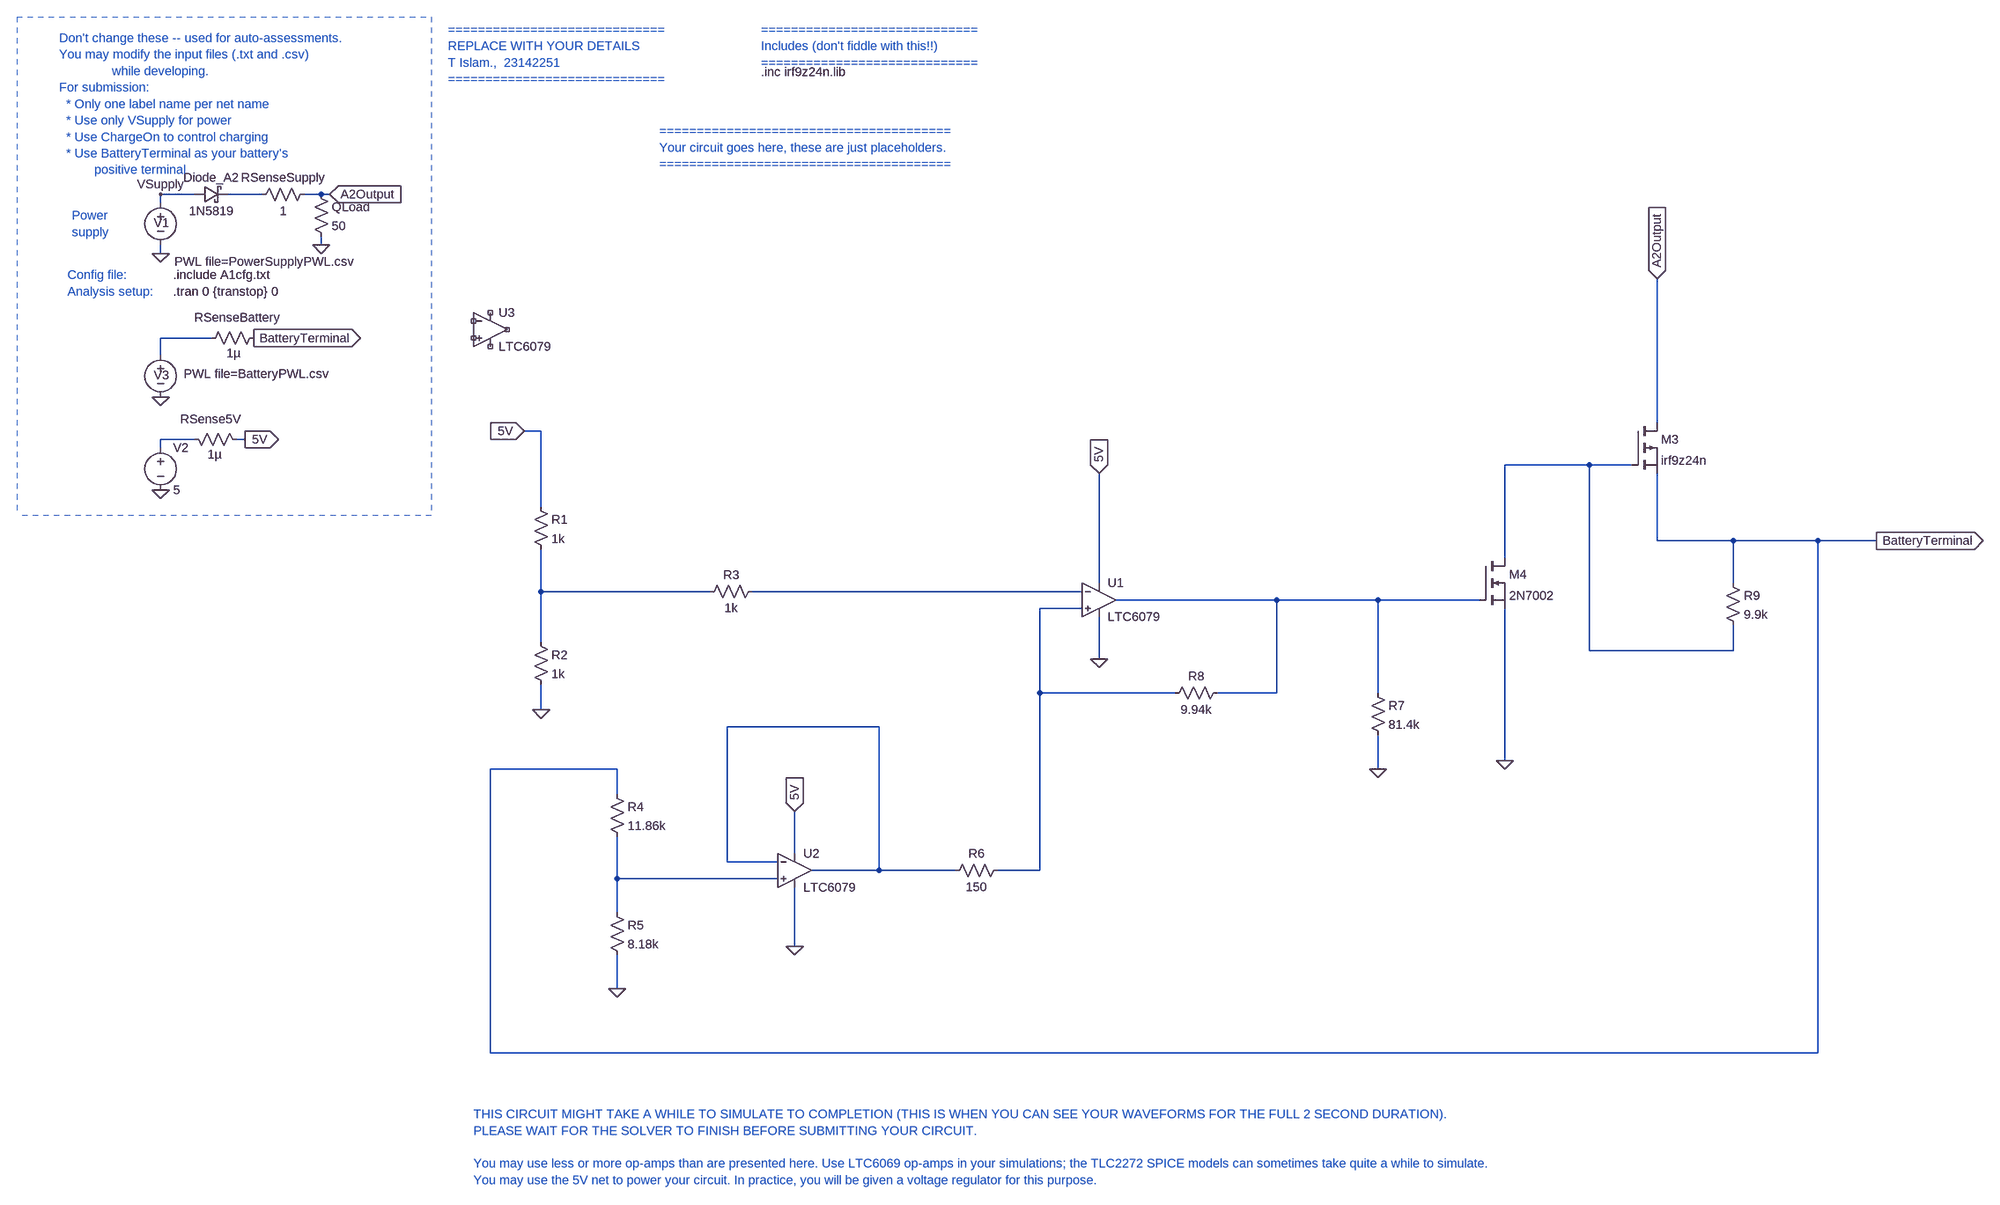
[diagram p0: schematic E344_23142251_A3.asc]
E344_23142251_A3.asc, the LTspice schematic file:
Version 4
SHEET 1 1824 1520
WIRE -2032 -1088 -2096 -1088
WIRE -1904 -1088 -1968 -1088
WIRE -1792 -1088 -1824 -1088
WIRE -1776 -1088 -1792 -1088
WIRE -2096 -1072 -2096 -1088
WIRE -1792 -992 -1792 -1008
WIRE -2096 -976 -2096 -992
WIRE -2000 -816 -2096 -816
WIRE -2096 -784 -2096 -816
WIRE 736 -656 736 -928
WIRE -1376 -640 -1408 -640
WIRE -2032 -624 -2096 -624
WIRE -1936 -624 -1952 -624
WIRE -2096 -608 -2096 -624
WIRE 608 -576 448 -576
WIRE 688 -576 608 -576
WIRE -1376 -496 -1376 -640
WIRE 736 -432 736 -560
WIRE 880 -432 736 -432
WIRE 1040 -432 880 -432
WIRE 1168 -432 1040 -432
WIRE 448 -400 448 -576
WIRE -320 -352 -320 -560
WIRE 880 -352 880 -432
WIRE -1376 -336 -1376 -416
WIRE -1056 -336 -1376 -336
WIRE -352 -336 -976 -336
WIRE 16 -320 -288 -320
WIRE 208 -320 16 -320
WIRE 400 -320 208 -320
WIRE -352 -304 -432 -304
WIRE -1376 -240 -1376 -336
WIRE 608 -224 608 -576
WIRE 880 -224 880 -272
WIRE 880 -224 608 -224
WIRE -320 -208 -320 -288
WIRE -432 -144 -432 -304
WIRE -176 -144 -432 -144
WIRE 16 -144 16 -320
WIRE 16 -144 -96 -144
WIRE 208 -144 208 -320
WIRE -1376 -112 -1376 -160
WIRE -736 -80 -1024 -80
WIRE 448 -16 448 -304
WIRE -1232 0 -1472 0
WIRE 208 0 208 -64
WIRE -1232 48 -1232 0
WIRE -896 160 -896 80
WIRE -1024 176 -1024 -80
WIRE -928 176 -1024 176
WIRE -736 192 -736 -80
WIRE -736 192 -864 192
WIRE -592 192 -736 192
WIRE -432 192 -432 -144
WIRE -432 192 -512 192
WIRE -1232 208 -1232 128
WIRE -928 208 -1232 208
WIRE -1232 272 -1232 208
WIRE -896 336 -896 224
WIRE -1232 416 -1232 352
WIRE -1472 608 -1472 0
WIRE 1040 608 1040 -432
WIRE 1040 608 -1472 608
FLAG -2096 -976 0
FLAG -1776 -1088 A2Output
IOPIN -1776 -1088 In
FLAG -1920 -816 BatteryTerminal
IOPIN -1920 -816 Out
FLAG -2096 -704 0
FLAG -1936 -624 5V
IOPIN -1936 -624 Out
FLAG -2096 -1088 VSupply
FLAG -1792 -992 0
FLAG -2096 -528 0
FLAG 1168 -432 BatteryTerminal
IOPIN 1168 -432 Out
FLAG 736 -928 A2Output
IOPIN 736 -928 In
FLAG -1408 -640 5V
IOPIN -1408 -640 In
FLAG -1376 -112 0
FLAG -1232 416 0
FLAG -320 -208 0
FLAG -896 336 0
FLAG -320 -560 5V
IOPIN -320 -560 In
FLAG -896 80 5V
IOPIN -896 80 In
FLAG 208 0 0
FLAG 448 -16 0
SYMBOL voltage -2096 -1088 R0
WINDOW 123 0 0 Left 0
WINDOW 39 0 0 Left 0
WINDOW 3 26 127 Left 2
WINDOW 0 -13 54 Left 2
SYMATTR Value PWL file=PowerSupplyPWL.csv
SYMATTR InstName V1
SYMBOL res -1904 -832 R90
WINDOW 0 -7 47 VBottom 2
WINDOW 3 29 54 VTop 2
SYMATTR InstName RSenseBattery
SYMATTR Value 1µ
SYMBOL schottky -2032 -1072 R270
WINDOW 0 32 32 VTop 2
WINDOW 3 0 32 VBottom 2
SYMATTR InstName Diode_A2
SYMATTR Value 1N5819
SYMATTR Description Diode
SYMATTR Type diode
SYMBOL voltage -2096 -800 R0
WINDOW 123 0 0 Left 0
WINDOW 39 0 0 Left 0
WINDOW 3 44 52 Left 2
WINDOW 0 -13 54 Left 2
SYMATTR Value PWL file=BatteryPWL.csv
SYMATTR InstName V3
SYMBOL res -1920 -1072 R270
WINDOW 0 32 56 VTop 2
WINDOW 3 0 56 VBottom 2
SYMATTR InstName RSenseSupply
SYMATTR Value 1
SYMBOL res -1808 -1104 R0
SYMATTR InstName QLoad
SYMATTR Value 50
SYMBOL voltage -2096 -624 R0
WINDOW 123 0 0 Left 0
WINDOW 39 0 0 Left 0
SYMATTR InstName V2
SYMATTR Value 5
SYMBOL res -2048 -640 M90
WINDOW 0 -7 47 VBottom 2
WINDOW 3 29 54 VTop 2
SYMATTR InstName RSense5V
SYMATTR Value 1µ
SYMBOL pmos 688 -656 R0
SYMATTR InstName M3
SYMATTR Value irf9z24n
SYMATTR Prefix X
SYMATTR SpiceModel irf9z24n
SYMBOL nmos 400 -400 R0
SYMATTR InstName M4
SYMATTR Value 2N7002
SYMBOL OpAmps\\LTC6079 -320 -320 R0
SYMATTR InstName U1
SYMBOL OpAmps\\LTC6079 -896 192 R0
SYMATTR InstName U2
SYMBOL OpAmps\\LTC6079 -1472 -832 R0
SYMATTR InstName U3
SYMBOL res -1392 -512 R0
SYMATTR InstName R1
SYMATTR Value 1k
SYMBOL res -1392 -256 R0
SYMATTR InstName R2
SYMATTR Value 1k
SYMBOL res -960 -352 R90
WINDOW 0 0 56 VBottom 2
WINDOW 3 32 56 VTop 2
SYMATTR InstName R3
SYMATTR Value 1k
SYMBOL res -1248 32 R0
SYMATTR InstName R4
SYMATTR Value 11.86k
SYMBOL res -1248 256 R0
SYMATTR InstName R5
SYMATTR Value 8.18k
SYMBOL res -496 176 R90
WINDOW 0 0 56 VBottom 2
WINDOW 3 32 56 VTop 2
SYMATTR InstName R6
SYMATTR Value 150
SYMBOL res 192 -160 R0
SYMATTR InstName R7
SYMATTR Value 81.4k
SYMBOL res -80 -160 R90
WINDOW 0 0 56 VBottom 2
WINDOW 3 32 56 VTop 2
SYMATTR InstName R8
SYMATTR Value 9.94k
SYMBOL res 864 -368 R0
SYMATTR InstName R9
SYMATTR Value 9.9k
TEXT -2072 -904 Left 2 !.tran 0 {transtop} 0
TEXT -2072 -936 Left 2 !.include A1cfg.txt
TEXT -2288 -1384 Left 2 ;Don't change these -- used for auto-assessments.\nYou may modify the input files (.txt and .csv) \n               while developing.\nFor submission: \n  * Only one label name per net name\n  * Use only VSupply for power\n  * Use ChargeOn to control charging\n  * Use BatteryTerminal as your battery's \n          positive terminal
TEXT -2272 -936 Left 2 ;Config file:
TEXT -2272 -904 Left 2 ;Analysis setup:
TEXT -2264 -1048 Left 2 ;Power\nsupply
TEXT -1552 -1400 Left 2 ;=============================\nREPLACE WITH YOUR DETAILS\nT Islam.,  23142251\n=============================
TEXT -960 -1320 Left 2 !.inc irf9z24n.lib
TEXT -960 -1400 Left 2 ;=============================\nIncludes (don't fiddle with this!!)\n=============================
TEXT -1152 -1208 Left 2 ;=======================================\nYour circuit goes here, these are just placeholders.\n=======================================
TEXT -1504 1392 Left 2 ;THIS CIRCUIT MIGHT TAKE A WHILE TO SIMULATE TO COMPLETION (THIS IS WHEN YOU CAN SEE YOUR WAVEFORMS FOR THE FULL 2 SECOND DURATION).\nPLEASE WAIT FOR THE SOLVER TO FINISH BEFORE SUBMITTING YOUR CIRCUIT.\n \nYou may use less or more op-amps than are presented here. Use LTC6069 op-amps in your simulations; the TLC2272 SPICE models can sometimes take quite a while to simulate.\nYou may use the 5V net to power your circuit. In practice, you will be given a voltage regulator for this purpose.
LINE Normal -1584 -1424 -1584 -480 2
LINE Normal -2368 -1424 -1584 -1424 2
LINE Normal -1584 -480 -2368 -480 2
LINE Normal -1584 -496 -1584 -496 2
LINE Normal -2368 -1424 -2368 -480 2

The netlist it stands for:
* E344_23142251_A3.asc
V1 VSupply 0 PWL file=PowerSupplyPWL.csv
RSenseBattery BatteryTerminal N002 1µ
Diode_A2 VSupply N001 1N5819
V3 N002 0 PWL file=BatteryPWL.csv
RSenseSupply N001 A2Output 1
R§QLoad A2Output 0 50
V2 N003 0 5
RSense5V N003 5V 1µ
XM3 A2Output N004 BatteryTerminal irf9z24n irf9z24n  ; pins D G S
M4 N004 N007 0 0 2N7002
XU1 N008 N006 5V 0 N007 LTC6078  ; LTC6079, pins In+ In- V+ V- OUT
XU2 N010 N009 5V 0 N009 LTC6078  ; LTC6079, pins In+ In- V+ V- OUT
XU3 NC_01 NC_02 NC_03 NC_04 NC_05 LTC6078  ; LTC6079, pins In+ In- V+ V- OUT
R1 5V N005 1k
R2 N005 0 1k
R3 N006 N005 1k
R4 BatteryTerminal N010 11.86k
R5 N010 0 8.18k
R6 N008 N009 150
R7 N007 0 81.4k
R8 N007 N008 9.94k
R9 BatteryTerminal N004 9.9k
.model D D
.lib standard.dio
.model NMOS NMOS
.model PMOS PMOS
.lib standard.mos
.tran 0 {transtop} 0
.include A1cfg.txt
* Don't change these -- used for auto-assessments.
* You may modify the input files (.txt and .csv)
*                while developing.
* For submission:
*   * Only one label name per net name
*   * Use only VSupply for power
*   * Use ChargeOn to control charging
*   * Use BatteryTerminal as your battery's
*           positive terminal
* Config file:
* Analysis setup:
* Power
* supply
* =============================
* REPLACE WITH YOUR DETAILS
* T Islam.,  23142251
* =============================
.inc irf9z24n.lib
* =============================
* Includes (don't fiddle with this!!)
* =============================
* =======================================
* Your circuit goes here, these are just placeholders.
* =======================================
* THIS CIRCUIT MIGHT TAKE A WHILE TO SIMULATE TO COMPLETION (THIS IS WHEN YOU CAN SEE YOUR WAVEFORMS FOR THE FULL 2 SECOND DURATION).
* PLEASE WAIT FOR THE SOLVER TO FINISH BEFORE SUBMITTING YOUR CIRCUIT.
* You may use less or more op-amps than are presented here. Use LTC6069 op-amps in your simulations; the TLC2272 SPICE models can sometimes take quite a while to simulate.
* You may use the 5V net to power your circuit. In practice, you will be given a voltage regulator for this purpose.
.lib LTC5.lib
.backanno
.end